# EAGLE schematic TouScruino-PJ-v0 (EAGLE 6.3)
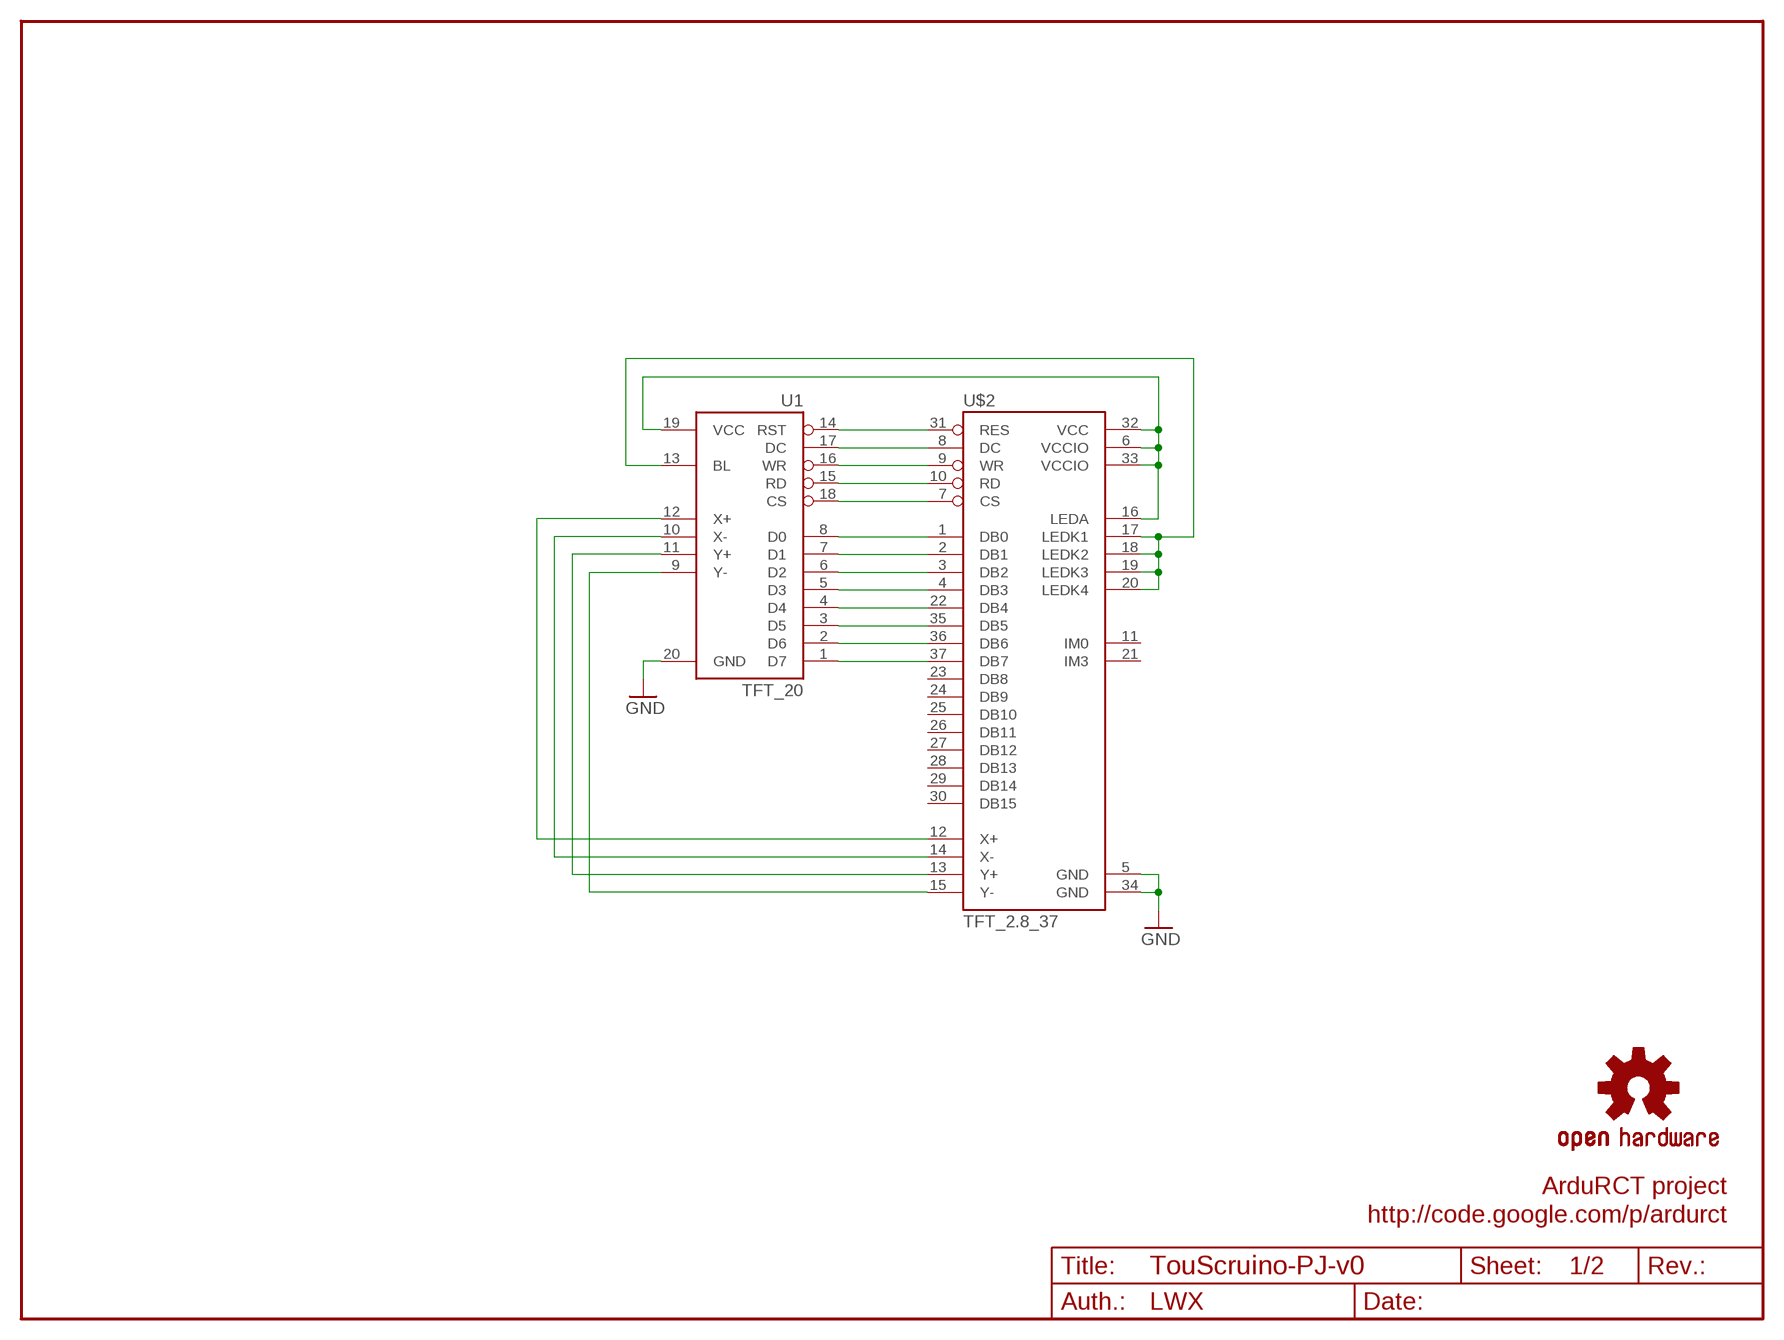
[diagram p0: schematic, sheet 1]

## Parts
U1  TFT_20  [1X20]
U$2  TFT_2.8_37  [TFT_2.8_37]
U$3  OSHW-LOGOM  [OSHW-LOGO-M]

## Nets
GND: U1.20(GND) U$2.5(GND) U$2.34(GND)
N$1: U1.19(VCC) U$2.6(VCCIO) U$2.16(LEDA) U$2.32(VCC) U$2.33(VCCIO)
N$2: U1.13(BL) U$2.17(LEDK1) U$2.18(LEDK2) U$2.19(LEDK3) U$2.20(LEDK4)
N$5: U1.9(Y-) U$2.15(Y-)
N$6: U1.11(Y+) U$2.13(Y+)
N$7: U1.10(X-) U$2.14(X-)
N$8: U1.12(X+) U$2.12(X+)
N$9: U1.14(RST) U$2.31(RES)
N$10: U1.17(DC) U$2.8(DC)
N$11: U1.16(WR) U$2.9(WR)
N$12: U1.15(RD) U$2.10(RD)
N$13: U1.18(CS) U$2.7(CS)
N$14: U1.8(D0) U$2.1(DB0)
N$15: U1.7(D1) U$2.2(DB1)
N$16: U1.6(D2) U$2.3(DB2)
N$17: U1.5(D3) U$2.4(DB3)
N$18: U1.4(D4) U$2.22(DB4)
N$19: U1.3(D5) U$2.35(DB5)
N$20: U1.2(D6) U$2.36(DB6)
N$21: U1.1(D7) U$2.37(DB7)
Unconnected: U$2.11(IM0) U$2.21(IM3) U$2.23(DB8) U$2.24(DB9) U$2.25(DB10) U$2.26(DB11) U$2.27(DB12) U$2.28(DB13) U$2.29(DB14) U$2.30(DB15)

## Notes on the sheet
- ArduRCT project
- http://code.google.com/p/ardurct
- 1/2
- LWX

## Library data of the parts
U1 = wibauxl:TFT_20
U$2 = wibauxl:TFT_2.8_37
U$3 = SparkFun:OSHW-LOGO: Open Source Hardware Logo This logo indicates the piece of hardware it is found on incorporates a OSHW license and/or adheres to the definition of open source hardware found here: http://freedomdefined.org/OSHW

## Net classes
0 default: width 0.203 mm
1 vcc: width 0.254 mm